# Altium project SmartDoor.PrjPcb
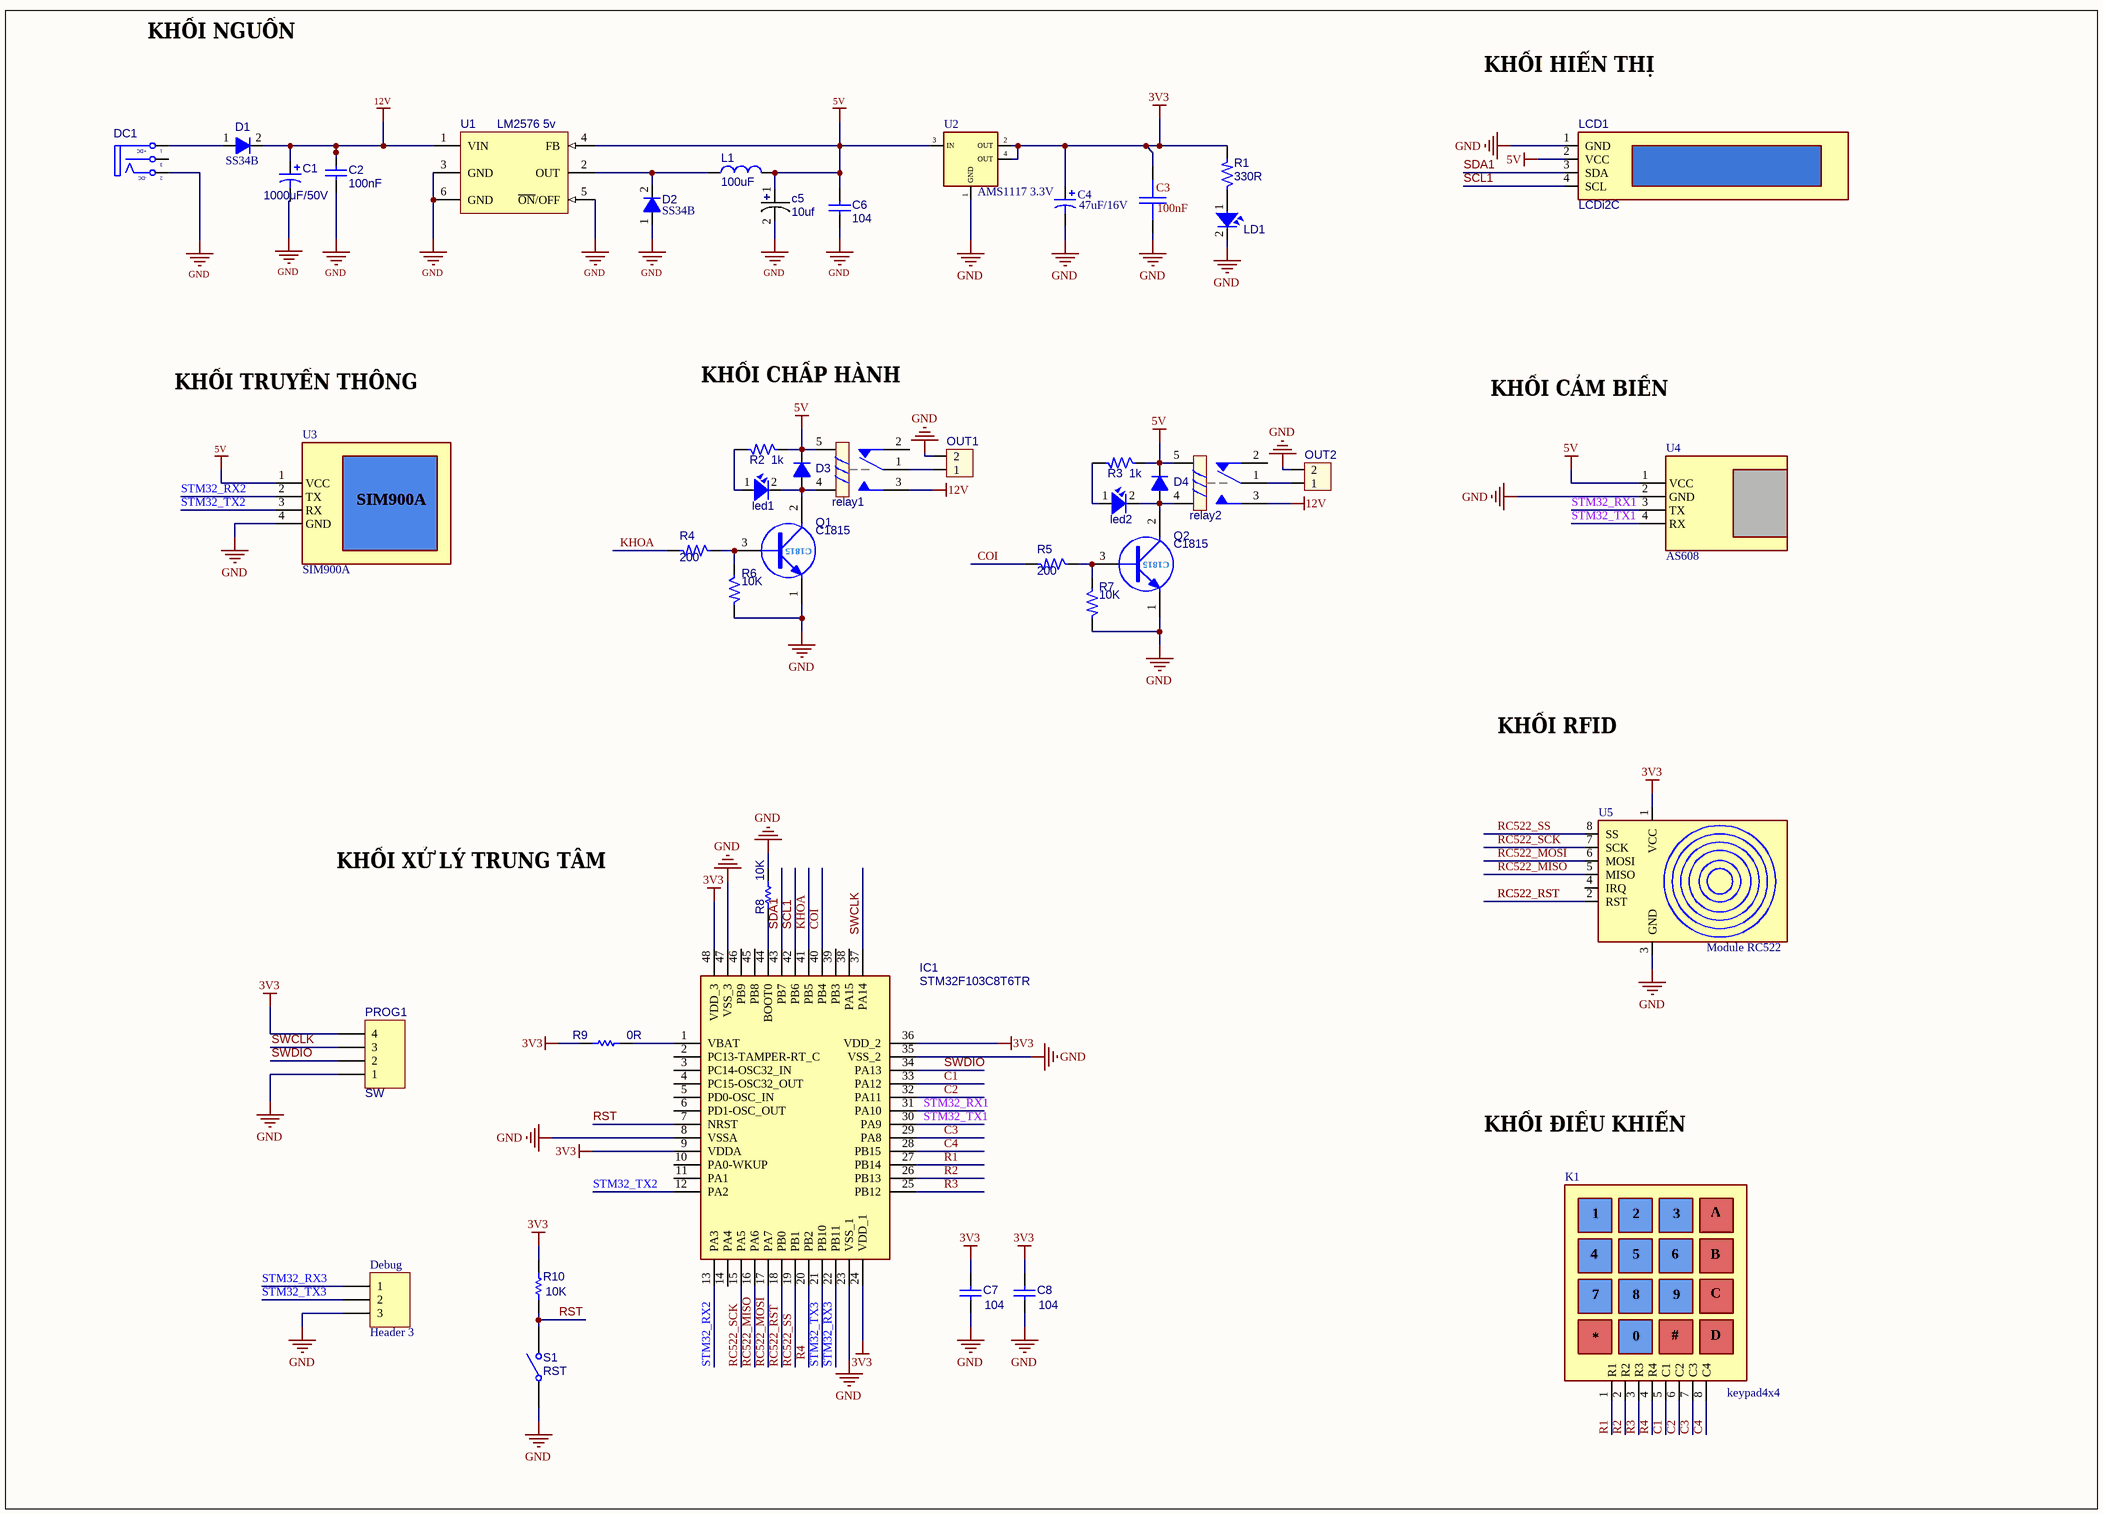
[diagram p0: Sheet1.SchDoc]
1 sheet, 44 parts. Net scope: global (net labels, ports and power ports of the same name join across sheets).
Board file: SmartDoor.PcbDoc

## Sheet Sheet1.SchDoc
size A3; SheetNumber: 1; SheetTotal: 1

### Parts
C1  value 1000uF/50V  [C_EL_10_12]  (hidden comment: 1000uF-50V-DIP)
C2  value 100nF  [C0805S]  (hidden comment: 100nF-50V-126)
C3  value 100nF  [C0805S]  (hidden comment: 0.1uF)
C4  value 47uF/16V  [6032]  (hidden comment: Tanta-47uF-16V-2917)
c5  10uf  [C_EL_10_9]
C6  104  [C0805S]
C7  value 104  [C0805S]  (hidden comment: Cap)
C8  value 104  [C0805S]  (hidden comment: Cap)
D1  SS34B  [D_SMB]
D2  SS34B  [D_SMB]
D3  diode  [D_SMA]  (value not drawn)
D4  diode  [D_SMA]  (value not drawn)
DC1  Jack DC5.5x2.5MM DC5525  [DC-IN]  (value not drawn)
Debug  Header 3  [XH_3]
IC1  STM32F103C8T6TR  [QFN48N]
K1  keypad4x4  [XH_8]
L1  100uF  [L_12]
LCD1  LCDi2C  [XH_4]
LD1  led 0805 green  [LED0805GRN]  (value not drawn)
led1  led  [led 5mm red dip]  (value not drawn)
led2  led  [led 5mm red dip]  (value not drawn)
OUT1  con2  [MSTBF_2]  (value not drawn)
OUT2  con2  [MSTBF_2]  (value not drawn)
PROG1  SW  [XH_4]
Q1  C1815  [TO-92W]
Q2  C1815  [TO-92W]
R1  330R  [R0805E]
R2  1k  [R0805E]
R3  1k  [R0805E]
R4  200  [R0125W_AX03]
R5  200  [R0125W_AX03]
R6  10K  [R0805E]
R7  10K  [R0805E]
R8  value 10K  [R0805E]  (hidden comment: Res1)
R9  value 0R  [R0805S]  (hidden comment: Res1)
R10  value 10K  [R0805S]  (hidden comment: Res1)
relay1  relay2  [RL_SPDT_10A]  (value not drawn)
relay2  relay2  [RL_SPDT_10A]  (value not drawn)
S1  RST  [SW1-SMD]
U1  LM2576 5v  [TO-263-5L, D2PAK-5, DDPAK, FMG170_5_S1000]
U2  AMS1117 3.3V  [ASM1117-3V3]
U3  SIM900A  [XH_4]
U4  AS608  [XH_4]
U5  Module RC522  [XH_8]

### Nets
3V3: C3.2 C4.1 C7.2 C8.2 IC1.9(VDDA) IC1.24(VDD_1) IC1.36(VDD_2) IC1.48(VDD_3) PROG1.4 R1.2 R9.2 R10.2 U2.2(OUT) U2.4(OUT) U5.1(VCC)
5V: c5.1 C6.2 D3.2(K) D4.2(K) L1.2 LCD1.2(VCC) R2.1 R3.1 relay1.5 relay2.5 U1.4(FB) U2.3(IN) U3.1(VCC) U4.1(VCC)
12V: C1.1 C2.1 D1.2(K) relay1.3 relay2.3 U1.1(VIN)
GND: C1.2 C2.2 C3.1 C4.2 c5.2 C6.1 C7.1 C8.1 D2.1(A) DC1.2(TN) Debug.3 IC1.8(VSSA) IC1.23(VSS_1) IC1.35(VSS_2) IC1.47(VSS_3) LCD1.1(GND) LD1.2 OUT1.2 OUT2.2 PROG1.1 Q1.1(E) Q2.1(E) R6.2 R7.2 R8.1 S1.1(COMMON) U1.3(GND) U1.5(~{ON}/OFF) U1.6(GND) U2.1(GND) U3.4(GND) U4.2(GND) U5.3(GND)
C1: IC1.33(PA12) K1.5(C1)
C2: IC1.32(PA11) K1.6(C2)
C3: IC1.29(PA8) K1.7(C3)
C4: IC1.28(PB15) K1.8(C4)
COI: IC1.40(PB4) R5.2
KHOA: IC1.41(PB5) R4.2
R1: IC1.27(PB14) K1.1(R1)
R2: IC1.26(PB13) K1.2(R2)
R3: IC1.25(PB12) K1.3(R3)
R4: IC1.20(PB2) K1.4(R4)
RC522_MISO: IC1.16(PA6) U5.5(MISO)
RC522_MOSI: IC1.17(PA7) U5.6(MOSI)
RC522_RST: IC1.18(PB0) U5.2(RST)
RC522_SCK: IC1.15(PA5) U5.7(SCK)
RC522_SS: IC1.19(PB1) U5.8(SS)
RST: IC1.7(NRST) R10.1 S1.2(NO)
SCL1: IC1.42(PB6) LCD1.4(SCL)
SDA1: IC1.43(PB7) LCD1.3(SDA)
STM32_RX1: IC1.31(PA10) U4.3(TX)
STM32_RX2: IC1.13(PA3) U3.2(TX)
STM32_RX3: Debug.1 IC1.22(PB11)
STM32_TX1: IC1.30(PA9) U4.4(RX)
STM32_TX2: IC1.12(PA2) U3.3(RX)
STM32_TX3: Debug.2 IC1.21(PB10)
SWCLK: IC1.37(PA14) PROG1.3
SWDIO: IC1.34(PA13) PROG1.2
NetD1_1: D1.1(A) DC1.1(T)
NetD2_2: D2.2(K) L1.1 U1.2(OUT)
NetD3_1: D3.1(A) led1.2 Q1.2(C) relay1.4
NetD4_1: D4.1(A) led2.2 Q2.2(C) relay2.4
NetIC1_1: IC1.1(VBAT) R9.1
NetIC1_44: IC1.44(BOOT0) R8.2
NetLD1_1: LD1.1(A) R1.1
Netled1_1: led1.1(A) R2.2
Netled2_1: led2.1(A) R3.2
NetOUT1_1: OUT1.1 relay1.1
NetOUT2_1: OUT2.1 relay2.1
NetQ1_3: Q1.3(B) R4.1 R6.1
NetQ2_3: Q2.3(B) R5.1 R7.1

Not connected (* = marked no-connect by the designer): DC1 3(S); IC1 2(PC13-TAMPER-RT_C) 3(PC14-OSC32_IN) 4(PC15-OSC32_OUT) 5(PD0-OSC_IN) 6(PD1-OSC_OUT) 10(PA0-WKUP) 11(PA1) 14(PA4) 38(PA15) 39(PB3) 45(PB8) 46(PB9); relay1 2; relay2 2; U5 4(IRQ)

### Notes on the sheet
- KHỐI NGUỒN
- KHỐI HIỂN THỊ
- KHỐI CHẤP HÀNH
- KHỐI TRUYỀN THÔNG
- KHỐI CẢM BIẾN
- KHỐI RFID
- KHỐI XỬ LÝ TRUNG TÂM
- KHỐI ĐIỀU KHIỂN
- (in symbol DCIN) +DC; -DC
- (in symbol keypad) A; B; C; 9; 0; #; D

### Library data of the parts
C1 C4 = Cap Pol1: Polarized Capacitor (Radial); Published: 8-Jun-2000; LatestRevisionDate: 17-Jul-2002; LatestRevisionNote: Re-released for DXP Platform.; PackageReference: RB7.6-15; Publisher: Altium Limited
C2 C7 C8 = Cap: Capacitor; Published: 8-Jun-2000; LatestRevisionDate: 17-Jul-2002; LatestRevisionNote: Re-released for DXP Platform.; PackageReference: RAD-0.3; Publisher: Altium Limited
  C7 C8: PackageDescription: Radial Cap, Thru-Hole; 2 Leads; 0.3 in Pin Spacing
C3 = C0402: Capacitor, Ceramic Chip, 16V, X7R, 10%; Manufacturer: Samsung Electromechanics; PartNumber: CL05B104KO5NNNC; Area: 2800; ComponentHeight: 0.022; SymbolVersion: 07/31/2009 12:17:27; PackageReference: 0402; ComponentLink1Description: AEO Datasheet Link
c5 = radial
C6 = Cap 104_SMD: Capacitor (Semiconductor SIM Model); Value: 0.1uF; Published: 8-Jun-2000; LatestRevisionDate: 17-Jul-2002; LatestRevisionNote: Re-released for DXP Platform.; PackageReference: C1206; Publisher: Altium Limited
D1 D2 = diode
DC1 = DCIN: Jac DC input; Value: Jac DC
Debug = Header 3: Header, 3-Pin; LatestRevisionDate: 17-Jul-2002; LatestRevisionNote: Re-released for DXP Platform.; Publisher: Altium Limited
IC1 = STM32F103C8T6TR: Integrated Circuit; Manufacturer_Name: STMicroelectronics; Datasheet Link: http://media.digikey.com/pdf/Data%20Sheets/ST%20Microelectronics%20PDFS/STM32F103x8,B.pdf; Height: 1.6mm; Manufacturer_Part_Number: STM32F103C8T6TR; Mouser Part Number: 511-STM32F103C8T6TR; Mouser Price/Stock: https://www.mouser.co.uk/ProductDetail/STMicroelectronics/STM32F103C8T6TR?qs=5HwTSiuA5HDxFj62n06yag%3D%3D; Arrow Part Number: STM32F103C8T6TR; Arrow Price/Stock: https://www.arrow.com/en/products/stm32f103c8t6tr/stmicroelectronics
K1 = keypad
L1 = L1: Inductor; Value: 150 mH
LD1 = led
PROG1 = Header 4: Header, 4-Pin; LatestRevisionDate: 17-Jul-2002; LatestRevisionNote: Re-released for DXP Platform.; Publisher: Altium Limited
R1-R7 = R: Resistor 1/4W; Value: R1/4W - 1K
R8-R10 = Res1: Resistor; Published: 8-Jun-2000; LatestRevisionDate: 17-Jul-2002; LatestRevisionNote: Re-released for DXP Platform.; PackageReference: AXIAL-0.3; Publisher: Altium Limited; PackageDescription: Axial Device, Thru-Hole; 2 Leads; 0.3 in Pin Spacing
S1 = SW-SPST: Single-Pole, Single-Throw Switch; Published: 24-Mar-1999; LatestRevisionDate: 17-Jul-2002; LatestRevisionNote: Re-released for DXP Platform.; PackageReference: SPST-2; Publisher: Altium Limited; PackageDescription: Switch; 2 Leads
U1 = LM2576T-5.0: SIMPLE SWITCHER; 3A Step-Down Voltage Regulator; Manufacturer: National Semiconductor; PackageTopMarking: NSUZXYTT*LM2576T*-5.0 P+; PowerWise: N; FirstPublished: 4-Dec-2008; DatasheetVersion: Aug-2004; PackageVersion: revJ, Jan-1992; PackageReference: T05A; Publisher: Altium Limited; PackageDescription: TO-220, Molded, 5 Lead, Straight; CompType: Switcher; PartNumber: LM2576T-5.0; RoHS: O; PinCount: 5; DigiKeyPartNumber: LM2576T-5.0-ND; Code_JEDEC: TO-220-AB; ComponentLink1Description: LM2576 Datasheet; ComponentLink1URL: http://www.national.com/ds/LM/LM2576.pdf; ComponentLink2Description: LM2576 Web Page; ComponentLink2URL: http://www.national.com/pf/LM/LM2576.html; ComponentLink3Description: T05A Package Page; ComponentLink3URL: http://www.national.com/packaging/folders/t05a.html
U2 = AMS1117
U4 = R307